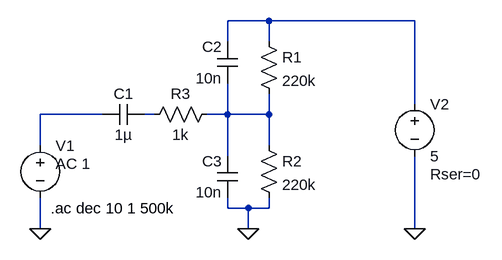
[diagram p0: schematic passive filter.asc]
passive filter.asc, the LTspice schematic file:
Version 4
SHEET 1 880 680
WIRE 368 16 304 16
WIRE 592 16 368 16
WIRE 304 48 304 16
WIRE 368 48 368 16
WIRE 592 144 592 16
WIRE 112 160 16 160
WIRE 192 160 176 160
WIRE 304 160 304 112
WIRE 304 160 272 160
WIRE 368 160 368 128
WIRE 368 160 304 160
WIRE 16 208 16 160
WIRE 368 208 368 160
WIRE 304 224 304 160
WIRE 304 304 304 288
WIRE 336 304 304 304
WIRE 368 304 368 288
WIRE 368 304 336 304
WIRE 16 336 16 288
WIRE 336 336 336 304
WIRE 592 336 592 224
FLAG 336 336 0
FLAG 16 336 0
FLAG 592 336 0
SYMBOL cap 176 144 R90
WINDOW 0 0 32 VBottom 2
WINDOW 3 32 32 VTop 2
SYMATTR InstName C1
SYMATTR Value 1µ
SYMBOL cap 320 112 R180
WINDOW 0 24 56 Left 2
WINDOW 3 24 8 Left 2
SYMATTR InstName C2
SYMATTR Value 10n
SYMBOL cap 320 288 R180
WINDOW 0 24 56 Left 2
WINDOW 3 24 8 Left 2
SYMATTR InstName C3
SYMATTR Value 10n
SYMBOL res 352 32 R0
SYMATTR InstName R1
SYMATTR Value 220k
SYMBOL res 352 192 R0
SYMATTR InstName R2
SYMATTR Value 220k
SYMBOL res 288 144 R90
WINDOW 0 0 56 VBottom 2
WINDOW 3 32 56 VTop 2
SYMATTR InstName R3
SYMATTR Value 1k
SYMBOL voltage 16 192 R0
WINDOW 123 24 44 Left 2
WINDOW 39 0 0 Left 2
SYMATTR Value2 AC 1
SYMATTR InstName V1
SYMATTR Value ""
SYMBOL voltage 592 128 R0
WINDOW 123 0 0 Left 2
WINDOW 39 24 124 Left 2
SYMATTR SpiceLine Rser=0
SYMATTR InstName V2
SYMATTR Value 5
TEXT 32 304 Left 2 !.ac dec 10 1 500k

The netlist it stands for:
* passive filter.asc
C1 N003 N002 1µ
C2 N004 N001 10n
C3 0 N004 10n
R1 N001 N004 220k
R2 N004 0 220k
R3 N004 N003 1k
V1 N002 0 AC 1
V2 N001 0 5 Rser=0
.ac dec 10 1 500k
.backanno
.end